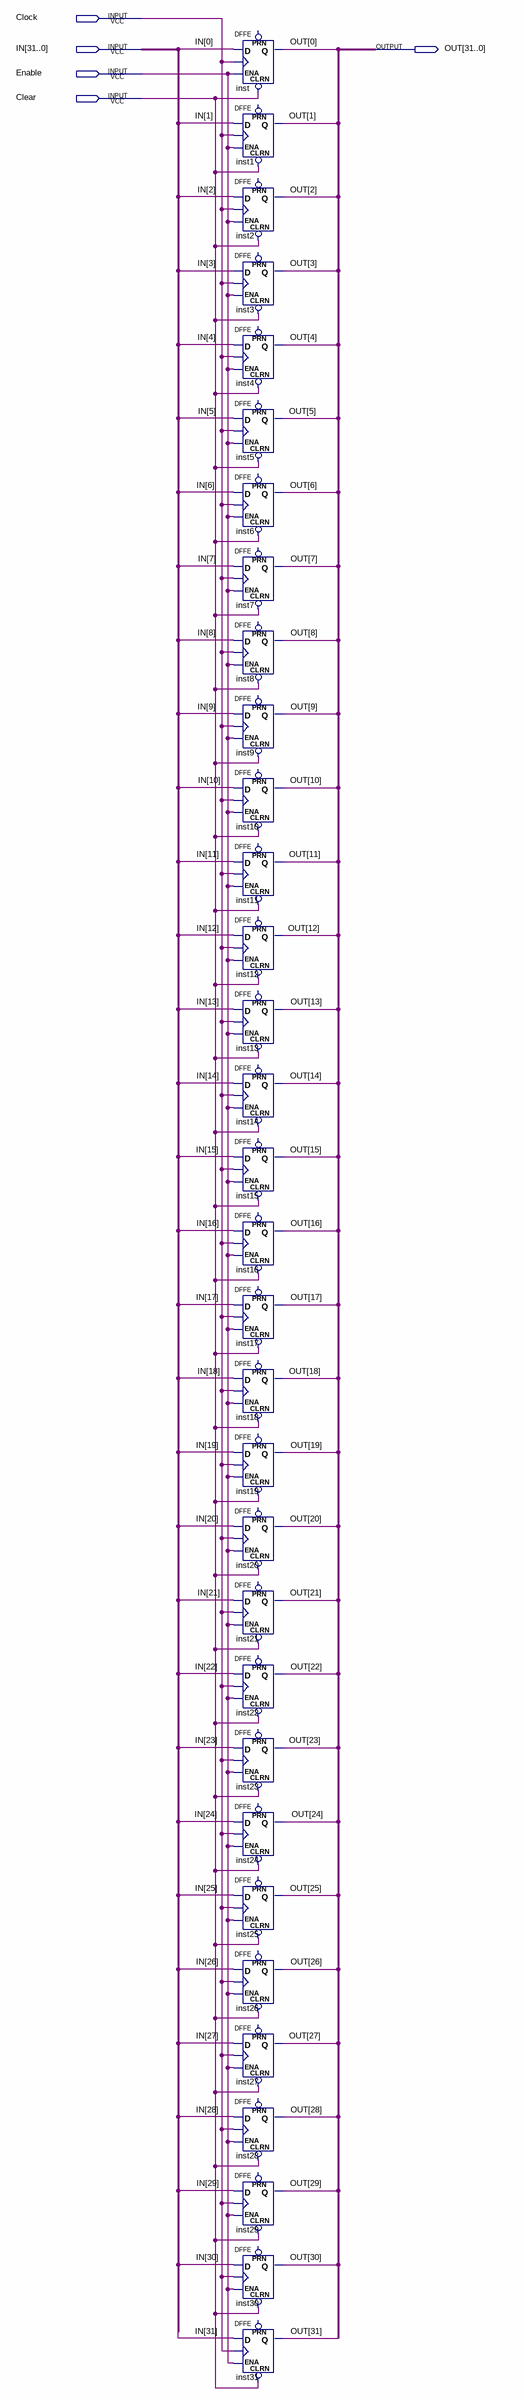
[diagram p0: schematic sheet]
// Quartus schematic reg_32_clear.bdf as structural Verilog: 32 symbols, 5 pins
module reg_32_clear (
  input  Clock,
  input  [31:0] IN,
  input  Enable,
  input  Clear,
  output [31:0] OUT
);

  DFFE inst (.CLRN(Clear), .D(IN[0]), .CLK(Clock), .ENA(Enable), .Q(OUT[0]));  // open: PRN
  DFFE inst1 (.CLRN(Clear), .D(IN[1]), .CLK(Clock), .ENA(Enable), .Q(OUT[1]));  // open: PRN
  DFFE inst2 (.CLRN(Clear), .D(IN[2]), .CLK(Clock), .ENA(Enable), .Q(OUT[2]));  // open: PRN
  DFFE inst3 (.CLRN(Clear), .D(IN[3]), .CLK(Clock), .ENA(Enable), .Q(OUT[3]));  // open: PRN
  DFFE inst4 (.CLRN(Clear), .D(IN[4]), .CLK(Clock), .ENA(Enable), .Q(OUT[4]));  // open: PRN
  DFFE inst5 (.CLRN(Clear), .D(IN[5]), .CLK(Clock), .ENA(Enable), .Q(OUT[5]));  // open: PRN
  DFFE inst6 (.CLRN(Clear), .D(IN[6]), .CLK(Clock), .ENA(Enable), .Q(OUT[6]));  // open: PRN
  DFFE inst7 (.CLRN(Clear), .D(IN[7]), .CLK(Clock), .ENA(Enable), .Q(OUT[7]));  // open: PRN
  DFFE inst8 (.CLRN(Clear), .D(IN[8]), .CLK(Clock), .ENA(Enable), .Q(OUT[8]));  // open: PRN
  DFFE inst9 (.CLRN(Clear), .D(IN[9]), .CLK(Clock), .ENA(Enable), .Q(OUT[9]));  // open: PRN
  DFFE inst10 (.CLRN(Clear), .D(IN[10]), .CLK(Clock), .ENA(Enable), .Q(OUT[10]));  // open: PRN
  DFFE inst11 (.CLRN(Clear), .D(IN[11]), .CLK(Clock), .ENA(Enable), .Q(OUT[11]));  // open: PRN
  DFFE inst12 (.CLRN(Clear), .D(IN[12]), .CLK(Clock), .ENA(Enable), .Q(OUT[12]));  // open: PRN
  DFFE inst13 (.CLRN(Clear), .D(IN[13]), .CLK(Clock), .ENA(Enable), .Q(OUT[13]));  // open: PRN
  DFFE inst14 (.CLRN(Clear), .D(IN[14]), .CLK(Clock), .ENA(Enable), .Q(OUT[14]));  // open: PRN
  DFFE inst15 (.CLRN(Clear), .D(IN[15]), .CLK(Clock), .ENA(Enable), .Q(OUT[15]));  // open: PRN
  DFFE inst16 (.CLRN(Clear), .D(IN[16]), .CLK(Clock), .ENA(Enable), .Q(OUT[16]));  // open: PRN
  DFFE inst17 (.CLRN(Clear), .D(IN[17]), .CLK(Clock), .ENA(Enable), .Q(OUT[17]));  // open: PRN
  DFFE inst18 (.CLRN(Clear), .D(IN[18]), .CLK(Clock), .ENA(Enable), .Q(OUT[18]));  // open: PRN
  DFFE inst19 (.CLRN(Clear), .D(IN[19]), .CLK(Clock), .ENA(Enable), .Q(OUT[19]));  // open: PRN
  DFFE inst20 (.CLRN(Clear), .D(IN[20]), .CLK(Clock), .ENA(Enable), .Q(OUT[20]));  // open: PRN
  DFFE inst21 (.CLRN(Clear), .D(IN[21]), .CLK(Clock), .ENA(Enable), .Q(OUT[21]));  // open: PRN
  DFFE inst22 (.CLRN(Clear), .D(IN[22]), .CLK(Clock), .ENA(Enable), .Q(OUT[22]));  // open: PRN
  DFFE inst23 (.CLRN(Clear), .D(IN[23]), .CLK(Clock), .ENA(Enable), .Q(OUT[23]));  // open: PRN
  DFFE inst24 (.CLRN(Clear), .D(IN[24]), .CLK(Clock), .ENA(Enable), .Q(OUT[24]));  // open: PRN
  DFFE inst25 (.CLRN(Clear), .D(IN[25]), .CLK(Clock), .ENA(Enable), .Q(OUT[25]));  // open: PRN
  DFFE inst26 (.CLRN(Clear), .D(IN[26]), .CLK(Clock), .ENA(Enable), .Q(OUT[26]));  // open: PRN
  DFFE inst27 (.CLRN(Clear), .D(IN[27]), .CLK(Clock), .ENA(Enable), .Q(OUT[27]));  // open: PRN
  DFFE inst28 (.CLRN(Clear), .D(IN[28]), .CLK(Clock), .ENA(Enable), .Q(OUT[28]));  // open: PRN
  DFFE inst29 (.CLRN(Clear), .D(IN[29]), .CLK(Clock), .ENA(Enable), .Q(OUT[29]));  // open: PRN
  DFFE inst30 (.CLRN(Clear), .D(IN[30]), .CLK(Clock), .ENA(Enable), .Q(OUT[30]));  // open: PRN
  DFFE inst31 (.CLRN(Clear), .D(IN[31]), .CLK(Clock), .ENA(Enable), .Q(OUT[31]));  // open: PRN
endmodule
